# Altium schematic sheet PCB_LED_CALENDAR__MAIN.SchDoc
size A3
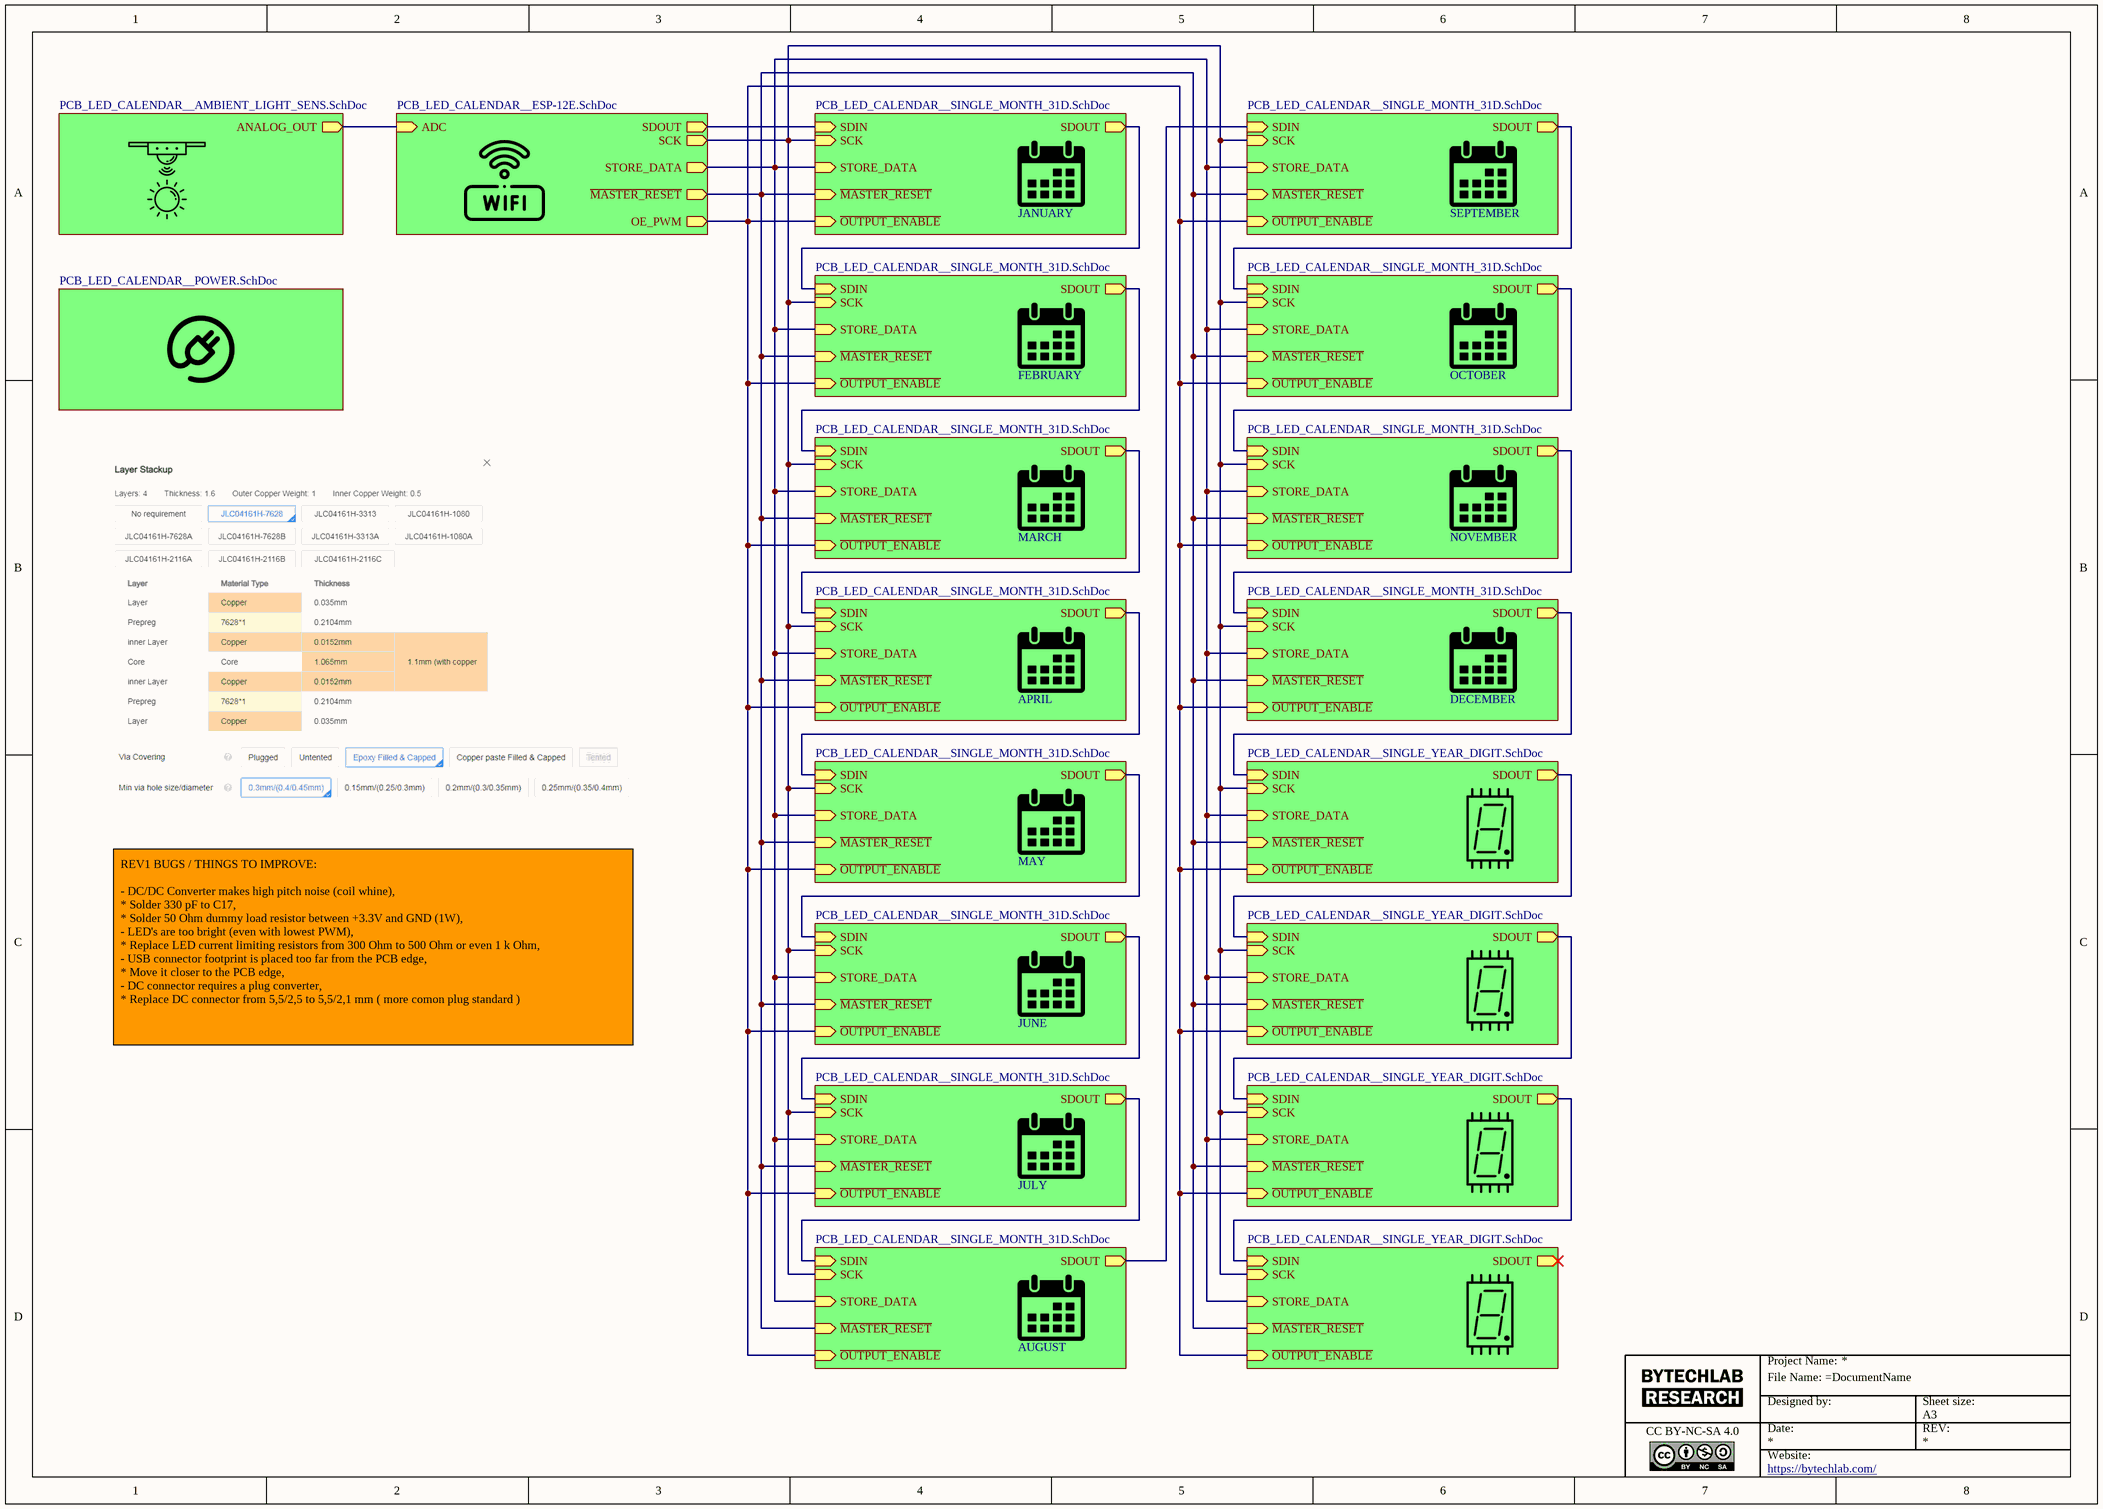
[diagram p0: PCB_LED_CALENDAR__MAIN.SchDoc]

## Sub-sheets
29D_1 = PCB_LED_CALENDAR__SINGLE_MONTH_31D.SchDoc: SDIN (in), SDOUT (out), ~{OUTPUT_ENABLE} (in), STORE_DATA (in), ~{MASTER_RESET} (in), SCK (in)
30D_1 = PCB_LED_CALENDAR__SINGLE_MONTH_31D.SchDoc: SDIN (in), SDOUT (out), ~{OUTPUT_ENABLE} (in), STORE_DATA (in), ~{MASTER_RESET} (in), SCK (in)
30D_2 = PCB_LED_CALENDAR__SINGLE_MONTH_31D.SchDoc: SDIN (in), SDOUT (out), ~{OUTPUT_ENABLE} (in), STORE_DATA (in), ~{MASTER_RESET} (in), SCK (in)
30D_3 = PCB_LED_CALENDAR__SINGLE_MONTH_31D.SchDoc: SDIN (in), SDOUT (out), ~{OUTPUT_ENABLE} (in), STORE_DATA (in), ~{MASTER_RESET} (in), SCK (in)
30D_4 = PCB_LED_CALENDAR__SINGLE_MONTH_31D.SchDoc: SDIN (in), SDOUT (out), ~{OUTPUT_ENABLE} (in), STORE_DATA (in), ~{MASTER_RESET} (in), SCK (in)
31D_1 = PCB_LED_CALENDAR__SINGLE_MONTH_31D.SchDoc: SDIN (in), SDOUT (out), ~{OUTPUT_ENABLE} (in), STORE_DATA (in), ~{MASTER_RESET} (in), SCK (in)
31D_2 = PCB_LED_CALENDAR__SINGLE_MONTH_31D.SchDoc: SDIN (in), SDOUT (out), ~{OUTPUT_ENABLE} (in), STORE_DATA (in), ~{MASTER_RESET} (in), SCK (in)
31D_3 = PCB_LED_CALENDAR__SINGLE_MONTH_31D.SchDoc: SDIN (in), SDOUT (out), ~{OUTPUT_ENABLE} (in), STORE_DATA (in), ~{MASTER_RESET} (in), SCK (in)
31D_4 = PCB_LED_CALENDAR__SINGLE_MONTH_31D.SchDoc: SDIN (in), SDOUT (out), ~{OUTPUT_ENABLE} (in), STORE_DATA (in), ~{MASTER_RESET} (in), SCK (in)
31D_5 = PCB_LED_CALENDAR__SINGLE_MONTH_31D.SchDoc: SDIN (in), SDOUT (out), ~{OUTPUT_ENABLE} (in), STORE_DATA (in), ~{MASTER_RESET} (in), SCK (in)
31D_6 = PCB_LED_CALENDAR__SINGLE_MONTH_31D.SchDoc: SDIN (in), SDOUT (out), ~{OUTPUT_ENABLE} (in), STORE_DATA (in), ~{MASTER_RESET} (in), SCK (in)
31D_7 = PCB_LED_CALENDAR__SINGLE_MONTH_31D.SchDoc: SDIN (in), SDOUT (out), ~{OUTPUT_ENABLE} (in), STORE_DATA (in), ~{MASTER_RESET} (in), SCK (in)
U_PCB_LED_CALENDAR__AMBIENT_LIGHT_SENS = PCB_LED_CALENDAR__AMBIENT_LIGHT_SENS.SchDoc: ANALOG_OUT (out)
U_PCB_LED_CALENDAR__ESP-12E = PCB_LED_CALENDAR__ESP-12E.SchDoc: ADC (in), SDOUT (out), SCK (out), OE_PWM (out), STORE_DATA (out), ~{MASTER_RESET} (out)
U_PCB_LED_CALENDAR__POWER = PCB_LED_CALENDAR__POWER.SchDoc: no entries
YD_1 = PCB_LED_CALENDAR__SINGLE_YEAR_DIGIT.SchDoc: SDIN (in), SDOUT (out), ~{OUTPUT_ENABLE} (in), STORE_DATA (in), ~{MASTER_RESET} (in), SCK (in)
YD_2 = PCB_LED_CALENDAR__SINGLE_YEAR_DIGIT.SchDoc: SDIN (in), SDOUT (out), ~{OUTPUT_ENABLE} (in), STORE_DATA (in), ~{MASTER_RESET} (in), SCK (in)
YD_3 = PCB_LED_CALENDAR__SINGLE_YEAR_DIGIT.SchDoc: SDIN (in), SDOUT (out), ~{OUTPUT_ENABLE} (in), STORE_DATA (in), ~{MASTER_RESET} (in), SCK (in)
YD_4 = PCB_LED_CALENDAR__SINGLE_YEAR_DIGIT.SchDoc: SDIN (in), SDOUT (out), ~{OUTPUT_ENABLE} (in), STORE_DATA (in), ~{MASTER_RESET} (in), SCK (in)

## Nets
(unnamed): sheet 30D_3/SDIN, sheet 31D_5/SDOUT
(unnamed): sheet 30D_3/SDOUT, sheet 31D_6/SDIN
(unnamed): sheet 30D_3/~{OUTPUT_ENABLE}, sheet 31D_6/~{OUTPUT_ENABLE}, sheet 30D_4/~{OUTPUT_ENABLE}, sheet 31D_7/~{OUTPUT_ENABLE}, sheet 31D_5/~{OUTPUT_ENABLE}, sheet 31D_4/~{OUTPUT_ENABLE}, sheet 30D_2/~{OUTPUT_ENABLE}, sheet 31D_3/~{OUTPUT_ENABLE}, sheet 30D_1/~{OUTPUT_ENABLE}, sheet 31D_2/~{OUTPUT_ENABLE}, sheet 29D_1/~{OUTPUT_ENABLE}, sheet 31D_1/~{OUTPUT_ENABLE}, sheet YD_1/~{OUTPUT_ENABLE}, sheet U_PCB_LED_CALENDAR__ESP-12E/OE_PWM, sheet YD_2/~{OUTPUT_ENABLE}, sheet YD_3/~{OUTPUT_ENABLE}, sheet YD_4/~{OUTPUT_ENABLE}
(unnamed): sheet 30D_3/STORE_DATA, sheet 31D_6/STORE_DATA, sheet 30D_4/STORE_DATA, sheet 31D_7/STORE_DATA, sheet 31D_5/STORE_DATA, sheet 31D_4/STORE_DATA, sheet 30D_2/STORE_DATA, sheet 31D_3/STORE_DATA, sheet 30D_1/STORE_DATA, sheet 31D_2/STORE_DATA, sheet 29D_1/STORE_DATA, sheet 31D_1/STORE_DATA, sheet YD_1/STORE_DATA, sheet U_PCB_LED_CALENDAR__ESP-12E/STORE_DATA, sheet YD_2/STORE_DATA, sheet YD_3/STORE_DATA, sheet YD_4/STORE_DATA
(unnamed): sheet 30D_3/~{MASTER_RESET}, sheet 31D_6/~{MASTER_RESET}, sheet 30D_4/~{MASTER_RESET}, sheet 31D_7/~{MASTER_RESET}, sheet 31D_5/~{MASTER_RESET}, sheet 31D_4/~{MASTER_RESET}, sheet 30D_2/~{MASTER_RESET}, sheet 31D_3/~{MASTER_RESET}, sheet 30D_1/~{MASTER_RESET}, sheet 31D_2/~{MASTER_RESET}, sheet 29D_1/~{MASTER_RESET}, sheet 31D_1/~{MASTER_RESET}, sheet YD_1/~{MASTER_RESET}, sheet U_PCB_LED_CALENDAR__ESP-12E/~{MASTER_RESET}, sheet YD_2/~{MASTER_RESET}, sheet YD_3/~{MASTER_RESET}, sheet YD_4/~{MASTER_RESET}
(unnamed): sheet 30D_3/SCK, sheet 31D_6/SCK, sheet 30D_4/SCK, sheet 31D_7/SCK, sheet 31D_5/SCK, sheet 31D_4/SCK, sheet 30D_2/SCK, sheet 31D_3/SCK, sheet 30D_1/SCK, sheet 31D_2/SCK, sheet 29D_1/SCK, sheet 31D_1/SCK, sheet YD_1/SCK, sheet U_PCB_LED_CALENDAR__ESP-12E/SCK, sheet YD_2/SCK, sheet YD_3/SCK, sheet YD_4/SCK
(unnamed): sheet 31D_6/SDOUT, sheet 30D_4/SDIN
(unnamed): sheet 30D_4/SDOUT, sheet 31D_7/SDIN
(unnamed): sheet 31D_7/SDOUT, sheet YD_1/SDIN
(unnamed): sheet 31D_5/SDIN, sheet 31D_4/SDOUT
(unnamed): sheet 31D_4/SDIN, sheet 30D_2/SDOUT
(unnamed): sheet 30D_2/SDIN, sheet 31D_3/SDOUT
(unnamed): sheet 31D_3/SDIN, sheet 30D_1/SDOUT
(unnamed): sheet 30D_1/SDIN, sheet 31D_2/SDOUT
(unnamed): sheet 31D_2/SDIN, sheet 29D_1/SDOUT
(unnamed): sheet 29D_1/SDIN, sheet 31D_1/SDOUT
(unnamed): sheet 31D_1/SDIN, sheet U_PCB_LED_CALENDAR__ESP-12E/SDOUT
(unnamed): sheet U_PCB_LED_CALENDAR__AMBIENT_LIGHT_SENS/ANALOG_OUT, sheet U_PCB_LED_CALENDAR__ESP-12E/ADC
(unnamed): sheet YD_1/SDOUT, sheet YD_2/SDIN
(unnamed): sheet YD_2/SDOUT, sheet YD_3/SDIN
(unnamed): sheet YD_3/SDOUT, sheet YD_4/SDIN

## Notes on the sheet
- JANUARY
- SEPTEMBER
- FEBRUARY
- OCTOBER
- MARCH
- NOVEMBER
- APRIL
- DECEMBER
- MAY
- REV1 BUGS / THINGS TO IMPROVE:
  - DC/DC Converter makes high pitch noise (coil whine),
  * Solder 330 pF to C17,
  * Solder 50 Ohm dummy load resistor between +3.3V and GND (1W),
  - LED's are too bright (even with lowest PWM),
  * Replace LED current limiting resistors from 300 Ohm to 500 Ohm or even 1 k Ohm,
  - USB connector footprint is placed too far from the PCB edge,
  * Move it closer to the PCB edge,
  - DC connector requires a plug converter,
  * Replace DC connector from 5,5/2,5 to 5,5/2,1 mm ( more comon plug standard )
- JUNE
- JULY
- AUGUST
- Project Name:
- File Name: =DocumentName
- CC BY-NC-SA 4.0
- Designed by:
- Date:
- Website:
- Sheet size:
- A3
- REV:
- https://bytechlab.com/